# EAGLE design Adafruit UPDI Friend (EAGLE 9.6.2)
COMPANY: ADAFRUIT INDUSTRIES; DRAWN: KTOWN; REV: A
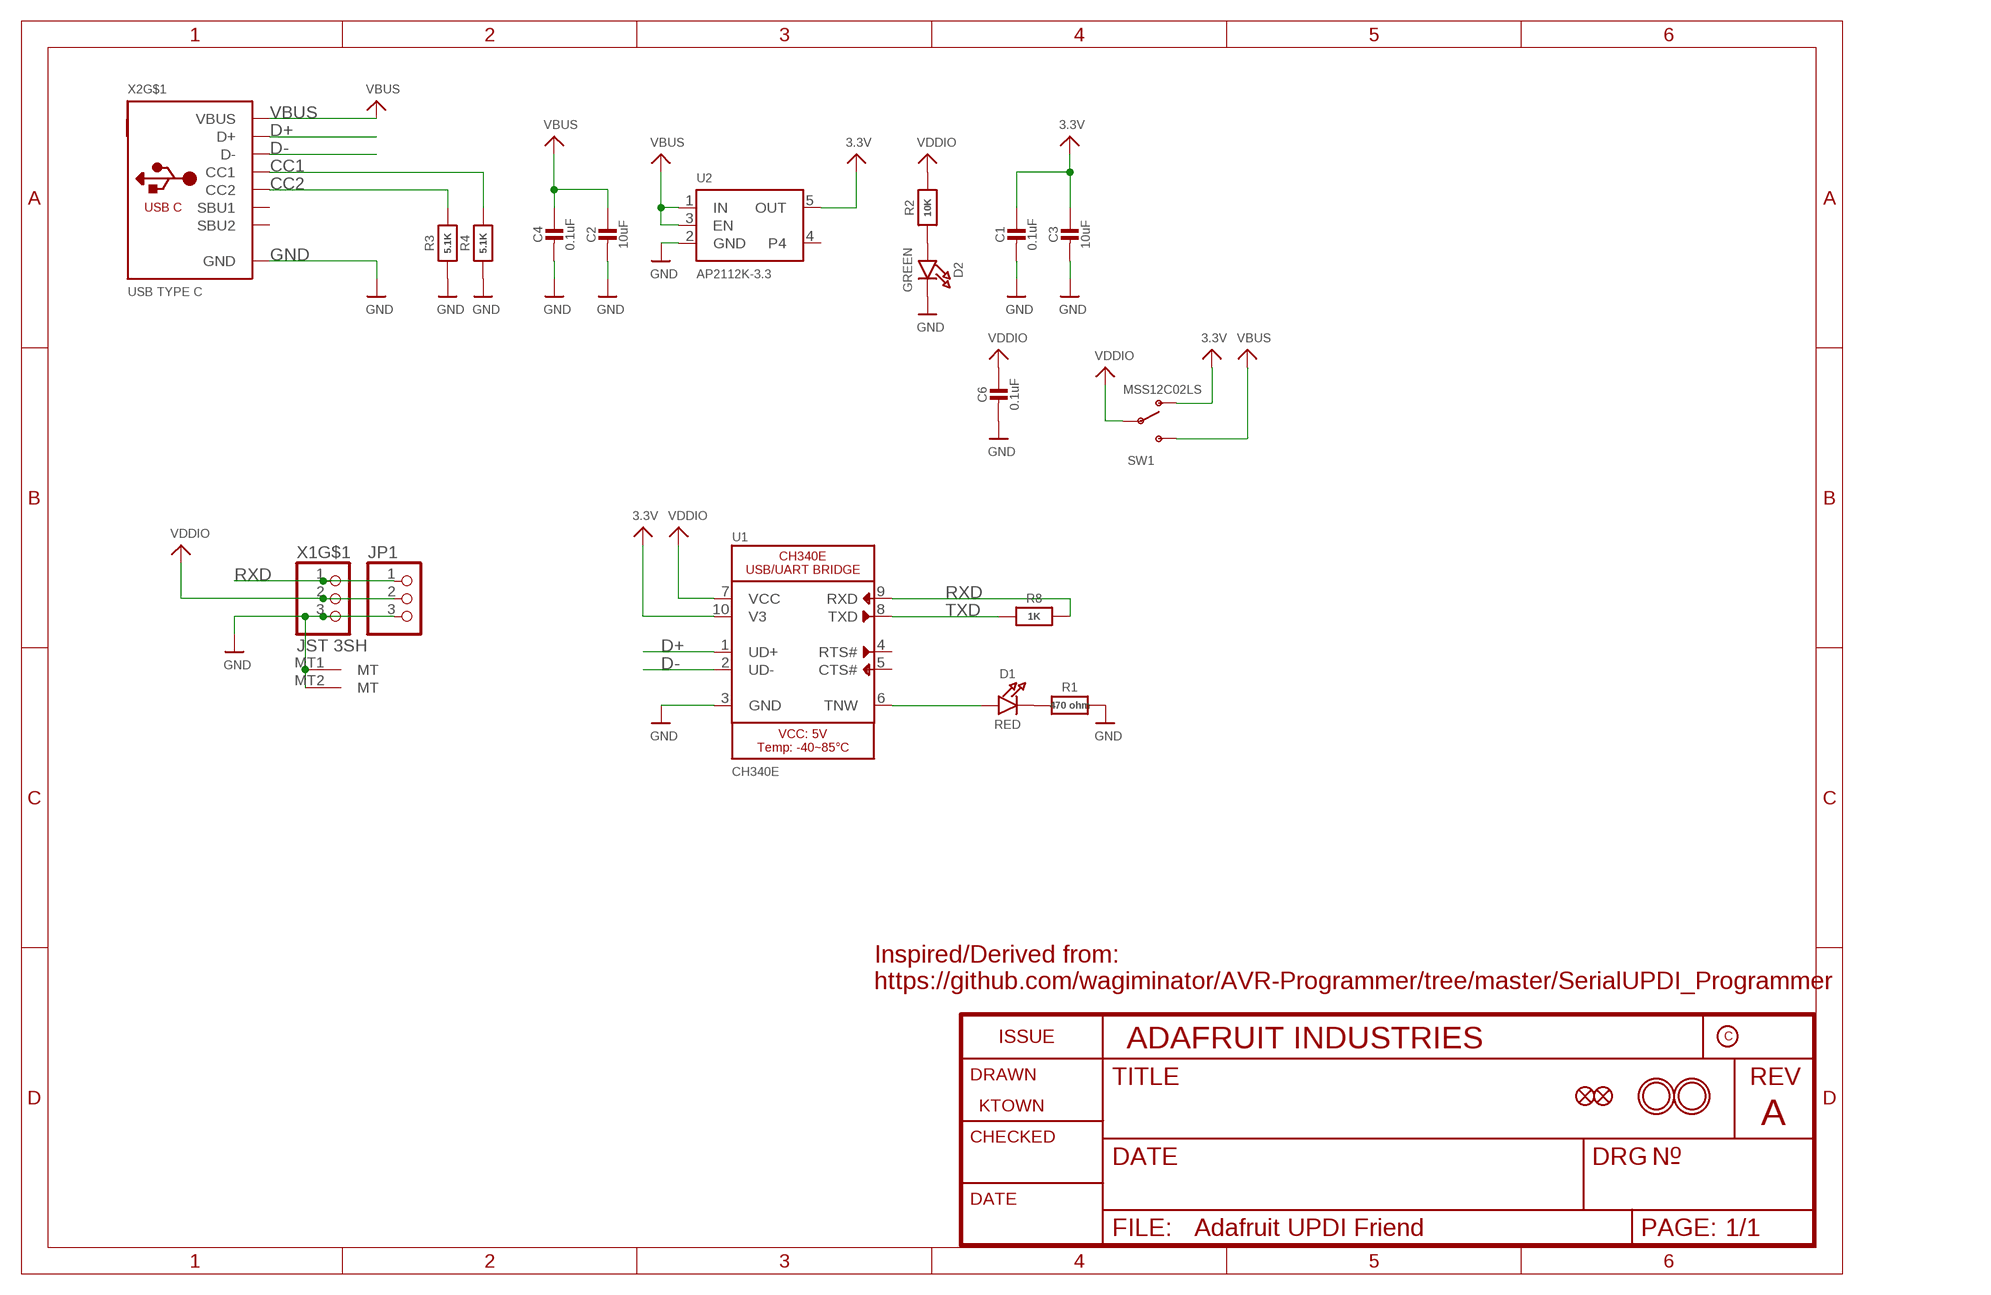
[diagram p0: schematic, sheet 1]

## Parts
C1  0.1uF  CAP_CERAMIC0603_NO  [0603-NO]
C2  10uF  CAP_CERAMIC0805-NOOUTLINE  [0805-NO]
C3  10uF  CAP_CERAMIC0805-NOOUTLINE  [0805-NO]
C4  0.1uF  CAP_CERAMIC0603_NO  [0603-NO]
C6  0.1uF  CAP_CERAMIC0603_NO  [0603-NO]
D1  RED  LED0603_NOOUTLINE  [CHIPLED_0603_NOOUTLINE]
D2  GREEN  LED0603_NOOUTLINE  [CHIPLED_0603_NOOUTLINE]
FID1  FIDUCIAL_1MM  [FIDUCIAL_1MM]
FID2  FIDUCIAL_1MM  [FIDUCIAL_1MM]
JP1  HEADER-1X376MIL  [1X03_ROUND_76]
R1  470 ohm  RESISTOR_0603_NOOUT  [0603-NO]
R2  10K  RESISTOR_0603_NOOUT  [0603-NO]
R3  5.1K  RESISTOR_0603_NOOUT  [0603-NO]
R4  5.1K  RESISTOR_0603_NOOUT  [0603-NO]
R8  1K  RESISTOR_0603_NOOUT  [0603-NO]
SW1  MSS12C02LS  SWITCH_SPDT  [SPDT_SMT_SSSS811101]
U1  CH340E  CH340E_MSOP10  [MSOP10]
U2  AP2112K-3.3  VREG_SOT23-5  [SOT23-5]
U$18  MOUNTINGHOLE2.0  [MOUNTINGHOLE_2.0_PLATED]
U$19  MOUNTINGHOLE2.0  [MOUNTINGHOLE_2.0_PLATED]
X1  JST 3SH  CON_JST_SH_3PINHORZ  [JST_SH3]
X2  USB TYPE C  USB_C  [USB_C_CUSB31-CFM2AX-01-X]

## Nets
3.3V: C1.1 C3.1 SW1.A(O) U1.10(V3) U2.5(OUT)
CC1: R4.2 X2.A5(CC1)
CC2: R3.2 X2.B5(CC2)
D+: U1.1(UD+) X2.A6(D+) X2.B6(D+)
D-: U1.2(UD-) X2.A7(D-) X2.B7(D-)
GND: C1.2 C2.2 C3.2 C4.2 C6.2 D2.C JP1.3 R1.2 R3.1 R4.1 U1.3(GND) U2.2(GND) X1.3 X1.MT1(MT) X1.MT2(MT) X2.A1B12(GND) X2.B1A12(GND)
N$1: D1.C R1.1
N$2: D1.A U1.6(TNW)
N$5: D2.A R2.1
RXD: JP1.1 R8.2 U1.9(RXD) X1.1
TXD: R8.1 U1.8(TXD)
VBUS: C2.1 C4.1 SW1.C(S) U2.1(IN) U2.3(EN) X2.A4B9(VBUS) X2.B4A9(VBUS)
VDDIO: C6.1 JP1.2 R2.2 SW1.B(P) U1.7(VCC) X1.2
Unconnected: U1.4(RTS#) U1.5(CTS#) U2.4 X2.A8(SBU1) X2.B8(SBU2) X2.M1(MT) X2.M2(MT) X2.M3(MT) X2.M4(MT)

## Notes on the sheet
- Inspired/Derived from:
  https://github.com/wagiminator/AVR-Programmer/tree/master/SerialUPDI_Programmer

## Library data of the parts
C1-C4 C6 = microbuilder:CAP_CERAMIC: Ceramic Capacitors For new designs, use the packages preceded by an '_' character since they are more reliable: The following footprints should be used on most boards: _0402 - Standard footprint for regular board layouts _0603 - Standard footprint for regular board layouts _0805 - Standard footprint for regular board layouts _1206 - Standard footprint for regular board layouts For extremely tight-pitch boards where space is at a premium, the following 'micro-pitch' footprints can be used (smaller pads, no silkscreen outline, etc.): _0402MP - Micro-pitch footprint for very dense/compact boards _0603MP - Micro-pitch footprint for very dense/compact boards _0805MP - Micro-pitch footprint for very dense/compact boards _1206MP - Micro-pitch footprint for very dense/compact boards
D1 D2 = microbuilder:LED: LED 0603 - 0603 Surface Mount Package 2mA: Green LED - Low Power (3.9mcd, 2ma, 1.7Vf) - Digikey: 475-2709-2-ND Orange LED - Low Power (9.8mcd, 2ma, 1.8Vf) - Digikey: 475-1194-2-ND Red LED - Low Power (5mcd, 2ma, 1.8Vf) - Digikey: 475-1195-2-ND Yellow LED - Low Power (7mcd, 2ma, 1.8Vf) - Digikey: 475-1196-2-ND 5mA: Blue LED - Low Power (17mcd, 5ma, 2.9Vf) - Digikey: LNJ937W8CRACT-ND 0805 - 0805 Surface Mount Package 2mA: Red LED (8.8mcd, 2mA, 1.8Vf, Clear) - Low Power [Digikey: 475-2510-1-ND] Green LED (5mcd, 2mA, 1.8Vf, Clear) - Low Power [Digikey: 475-2730-1-ND] Yellow LED (11.3mcd, 2mA, 1.8Vf, Clear) - Low Power [Digikey: 475-2555-1-ND] 20mA: Red LED (104mcd, 20mA, Diffused) - LS R976 [Digikey: 475-1278-6-ND] Red LED (12mcd, 20mA, 2.0Vf, Clear) - APT2012EC [Digikey: 754-1128-1-ND] Green LED (15mcd, 20mA, 2.2Vf, Clear) - APT2012GC [Digikey: 754-1131-1-ND] Orange LED (160mcd, 20mA, 2.1Vf, Clear) - APT2012SECK [Digikey: 754-1130-1-ND] 1206 - 1206 Surface Mount Package Green LED (26mcd, 20mA, Diffused) - LG N971 [Digikey: 475-1407-6-ND] Red LED (15mcd, 20mA, Diffused) - LH N974 [Digikey: 475-1416-6-ND] Cree - Cree High-Power Surface Mount LEDs XPEBWT-L1-0000-00D50 - White 111lm 350mA 2.9Vf 6200K 110° XTEAWT-00-0000-00000LEE3 - White 114lm 350mA 2.85Vf 5000K 115° Everlight - Everlight 45-21 Series Surface Mount LEDs 45-21/QK2C-B2832AC2CB2/2T - Warm White 2000mcd 20mA 3.25Vf 3050K 120° 45-21/LK2C-B38452C4CB2/2T - Nuetral White 2000mcd 20mA 3.25Vf 4150K 120° 45-21/LK2C-B50634C6CB2/2T - Cold White 2200mcd 20mA 3.25Vf 5650K 120° PLCC2 Reverse Mount LS T77K-J1L2-1-0-2-R18-Z - Red 11.25mcd 2mA 1.8Vf 630nm 120° LO T77K-L1M2-24-Z - Orange 19.6mcd 2mA 1.8Vf 606nm 120° LY T77K-K2M1-26-Z - Yellow 15.7mcd 2mA 1.8Vf 587nm 120°; ROT: 270
FID1 FID2 = microbuilder:FIDUCIAL: Fiducial Alignment Points Various fiducial points for machine vision alignment.; BOM: EXCLUDE
JP1 = microbuilder:HEADER-1X3: PIN HEADER
R1-R4 R8 = microbuilder:RESISTOR: Resistors For new designs, use the packages preceded by an '_' character since they are more reliable: The following footprints should be used on most boards: _0402 - Standard footprint for regular board layouts _0603 - Standard footprint for regular board layouts _0805 - Standard footprint for regular board layouts _1206 - Standard footprint for regular board layouts For extremely tight-pitch boards where space is at a premium, the following 'micro-pitch' footprints can be used (smaller pads, no silkscreen outline, etc.): _0402MP - Micro-pitch footprint for very dense/compact boards _0603MP - Micro-pitch footprint for very dense/compact boards _0805MP - Micro-pitch footprint for very dense/compact boards _1206MP - Micro-pitch footprint for very dense/compact boards
SW1 = adafruit_electromech:SWITCH_SPDT: Switch - SPDT SSSS811101 - Horizontal Two Position SMT, 0.3A 4V [Mouser: 688-SSSS811101]
U1 = microbuilder:CH340E: CH340E Full Speed USB to UART Bridge Baud Rates: 50bps - 2Mbps Software compatible with CH341
U2 = adafruit_power:VREG_SOT23-5: SOT23-5 Fixed Voltage Regulators Part Current Out V Out V In V Dropout θJA (°C/W) TJ (°C) Digikey Part No. ADP121 150mA 3.3V 3.4-5.5V 0.09V @ 150mA -- -- ADP121-AUJZ33R7CT-ND ADP121 150mA 3.0V 3.1-5.5V 0.09V @ 150mA -- -- ADP121-AUJZ30R7CT-ND ADP122 300mA 3.3V 3.4-5.5V 0.085V @ 300mA -- -- ADP122AUJZ-3.3-R7CT-ND ADP1712 300mA 3.3V 3.5-5.5V 0.17V @ 300mA -- -- ADP1712AUJZ-3.3-R7TR-ND AP7311 (Low Cost) 150mA 3.3V 3.5-6V 0.15V @ 150mA -- -- AP7311-33WG-7DICT-ND LD39015M18R 150mA 1.8V 1.9V-5.5V 0.08V @ 100mA -- -- 497-6977-1-ND LP2985A-33DBVR 150mA 3.3V 3.3-16V 0.28V @ 150mA 206 150 296-18479-1-ND MCP1824T-3302E/OT 300mA 3.3V 3.5V-6V 0.2V @ 300mA -- -- MCP1824T-3302E/OTCT-ND MIC5205-2.5YM5 TR 150mA 2.5V 2.7-16V 0.165V @ 150mA -- -- 576-1257-2-ND MIC5205-3.0YM5 TR 150mA 3.0V 3.2V-16V 0.165V @ 150mA -- -- 576-1258-2-ND MIC5205-3.3YM5 TR 150mA 3.3V 3.5V-16V 0.165V @ 150mA -- -- 576-1259-2-ND TPS780330220 150mA 3.3V+2.2V 3.6-5.5V 250mV Max -- -- 296-23332-1-ND TDA3663/N1,135 100mA 3.3V 3.5-45V 0.18V @ 50mA -- -- 568-5343-1-ND Max operating temp can be calculated using θJA, TJ (max junction temperature), and power in watts. Set the "Maximum Ambient Temperature" until it reaches TJ ("Max Junction Temperature"), which is the absolute limit for safe use of the regulator: Heat Sink Temperature Calculator <http://www.daycounter.com/Calculators/Heat-Sink-Temperature-Calculator.phtml> For example, With 12V source into a 3.3V LP2985 and a 30mA load, we are dissipating (12V-3.3V) * 0.03A = 0.261W. With a θJA of 206 °C/W, a TJ of 150°C, and 261mW we can safely use the chip without a heat sink up to 75°C (=147.1°C Junction Temperature).; JLC_ROTATION: 0
U$18 U$19 = adafruit_electromech:MOUNTINGHOLE: Mounting Hole For #2 screws (0.086"/2.18mm width, 0.094"/2.4mm hole) use 2.5mm; BOM: EXCLUDE
X1 = adafruit_electromech:CON_JST_SH_3PIN
X2 = adafruit_electromech:USB_C: USB Type-C USB 2.0 Connector; LCSC: C165948

## Board
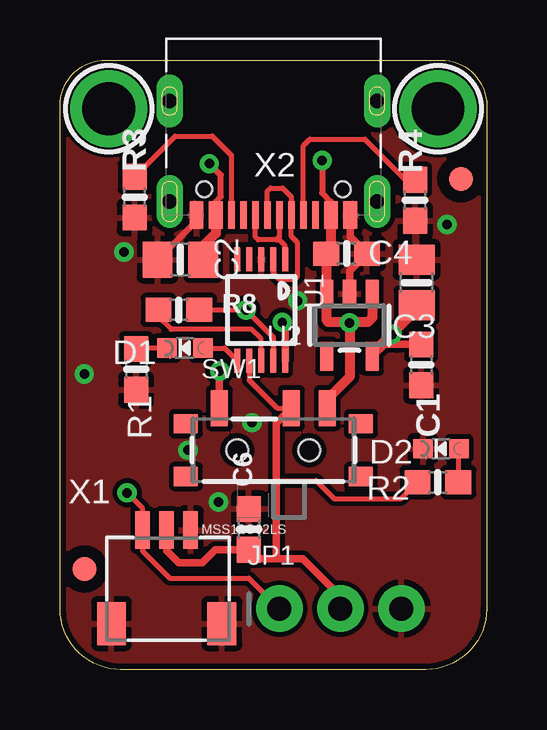
[diagram p1: board, top side]
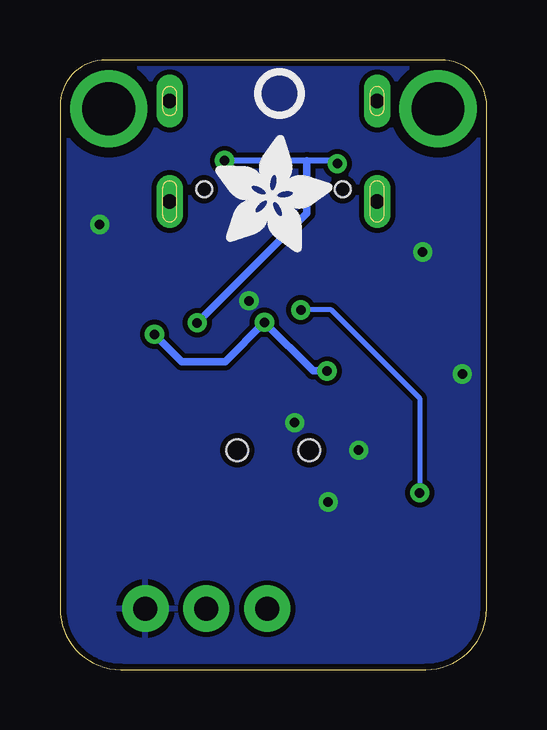
[diagram p2: board, bottom side, seen from below]

Size 17.78 x 25.4 mm. Coordinates in mm from the lower left corner, seen from the top.
Outline: 17.78,23.5 17.78,2.54 arc-90 15.24,0 2.54,0 arc-90 0,2.54 0,23.5 arc-90 1.91,25.4 15.88,25.4 arc-90 17.78,23.5
Copper layers (1*16): Top 0.035mm / dielectric 1.5mm / Bottom 0.035mm
Design rules "adafruit *": minimum track width 8mil, minimum drill 15.5mil, track to track 8mil, track to pad 8mil, pad to pad 8mil, via to via 8mil, smd to smd 8mil, copper to edge 10mil, drill to drill 8mil, minimum pad ring 10mil, minimum via ring 8mil, stop-mask expansion 2mil, vias tented up to drill 20mil, thermal gap 10mil

### Footprints (pad centres in the part's own frame; a part is rotated, then mirrored left to right if it is on the bottom)
0603-NO = smd 1.075 x 1: 1 -0.85,0; 2 0.85,0
0805-NO = smd 1.24 x 1.5: 1 -0.95,0; 2 0.95,0
CHIPLED_0603_NOOUTLINE = smd 0.8 x 0.8: A 0,-0.75; C 0,0.75
FIDUCIAL_1MM = smd 1 x 1: 1 0,0
1X03_ROUND_76 = drill 1 pad 1.93: 1 -2.54,0; 2 0,0; 3 2.54,0
SPDT_SMT_SSSS811101 = smd 0.7 x 1.5: A -2.25,1.242; B 0.75,1.242; C 2.25,1.242 | smd 1 x 0.8: SUP1 -3.65,0.592; SUP2 -3.65,-1.608; SUP3 3.65,0.592; SUP4 3.65,-1.608 | hole 0.9: -1.5,-0.508; 1.5,-0.508
MSOP10 = smd 0.25 x 1: 1 -1,-2.113; 2 -0.5,-2.113; 3 0,-2.113; 4 0.5,-2.113; 5 1,-2.113; 6 1,2.113; 7 0.5,2.113; 8 0,2.113; 9 -0.5,2.113; 10 -1,2.113
SOT23-5 = smd 0.55 x 1.2: 1 -0.95,-1.3; 2 0,-1.3; 3 0.95,-1.3; 4 0.95,1.3; 5 -0.95,1.3
MOUNTINGHOLE_2.0_PLATED = drill 2.2 pad 3: P$1 0,0
JST_SH3 = smd 0.6 x 1.55: 1 -1,2.006; 2 0,2.006; 3 1,2.006 | smd 1.2 x 1.8: MT1 -2.3,-1.894; MT2 2.3,-1.894
USB_C_CUSB31-CFM2AX-01-X = smd 0.575 x 1.15: A1B12 -3.2,2.275; A4B9 -2.4,2.275; B1A12 3.2,2.275; B4A9 2.4,2.275 | smd 0.275 x 1.15: A5 -1.25,2.275; A6 -0.25,2.275; A7 0.25,2.275; A8 1.25,2.275; B5 1.75,2.275; B6 0.75,2.275; B7 -0.75,2.275; B8 -1.75,2.275 | drill 0.6 pad 1 long: M1 -4.32,1.7; M2 4.32,1.7; M3 -4.32,-2.48; M4 4.32,-2.48 | hole 0.65: 2.89,1.2; -2.89,1.2

### Placement (x,y rotation side)
C1  15.05,12.7 270 top
C2  5.02,17.08 180 top
C3  14.86,16.13 90 top
C4  11.94,17.34 0 top
C6  7.87,5.84 90 top
D1  5.21,13.4 90 top
D2  15.88,9.21 90 top
FID1  1.02,4.19 0 top
FID2  16.7,20.45 0 top
JP1  11.68,2.54 0 top
PLABEL0  [PLABEL0]  9.14,3.68 90 top
PLABEL1  [PLABEL1]  11.68,3.68 90 top
PLABEL2  [PLABEL2]  14.22,3.68 90 top
PLABEL3  [PLABEL3]  13.72,8.13 90 top
PLABEL4  [PLABEL4]  4.06,8.38 90 top
PLABEL5  [PLABEL5]  4.19,12.19 0 top
PLABEL6  [PLABEL6]  14.48,10.41 0 top
PLABEL7  [PLABEL7]  2.16,5.71 90 top
PLABEL8  [PLABEL8]  9.02,13.72 0 bottom
PLABEL9  [PLABEL9]  3.17,1.4 90 bottom
PLABEL10  [PLABEL10]  4.45,1.4 90 bottom
PLABEL11  [PLABEL11]  5.71,1.4 90 bottom
PLABEL12  [PLABEL12]  4.57,5.97 0 bottom
R1  3.17,12.51 270 top
R2  15.75,7.81 180 top
R3  3.11,19.68 90 top
R4  14.8,19.56 90 top
R8  4.95,14.99 0 top
SW1  8.89,9.65 0 top
U1  8.38,14.99 180 top
U2  12.06,14.35 180 top
U$9  [ADAFRUIT_5MM]  11.3,17.4 0 bottom
U$17  [PCBFEAT-REV-040]  8.64,24 0 bottom
U$18  15.75,23.37 0 top
U$19  2.03,23.37 0 top
X1  4.45,3.81 0 top
X2  8.89,21.21 180 top

### Tracks (layer width: path | path; a pad name or v marks a point on that pad's centre or on a via)
3.3V  (via drill 0.39)
  Top 0.305: U2.5 13.52,13.56 C1.1 14.03,13.55 13.73,13.86 v13.84,13.97 | v9.26,14.47 9.38,14.35 U1.10 | SW1.A 6.64,12.43 v6.65,12.44
  Top 0.406: C3.1 14.86,15.02 13.02,13.18 U2.5
  Bottom 0.305: v13.84,13.97 12.7,12.83 10.9,12.83 v9.26,14.47 7.24,12.44 v6.65,12.44
CC1
  Top 0.203: X2.A5 10.14,21.82 10.41,22.1 12.7,22.1 14.39,20.41 R4.2
CC2
  Top 0.203: R3.2 4.8,22.23 6.35,22.23 7.14,21.43 X2.B5
D+
  Top 0.203: X2.A6 9.14,18.03 9.08,17.97 | 9.08,17.97 9.02,17.91 8.26,17.91 8.14,18.02 X2.B6 | U1.1 9.38,17.67 9.08,17.97
D-
  Top 0.203: X2.A7 8.64,19.94 8.76,20.07 9.27,20.07 9.64,19.7 X2.B7 9.64,18.05 9.91,17.78 9.91,16.38 9.78,16.26 9.14,16.26 8.88,16.52 U1.2
GND  (via drill 0.39)
  Top 0.254: X2.B1A12 5.69,18.7 C2.2
  Top 0.305: X2.A1B12 12.09,18.03 C4.2 12.06,16.61 U2.2
  other vias: 9.91,15.37 5.33,9.14 8,10.29 1.02,12.32 2.67,17.4 16.13,18.54 6.6,6.99
  pour Top: 17.78,25.27 0,25.27 0,0 17.78,0
  pour Bottom: 17.78,25.4 0,25.27 0,0 17.78,0
N$1
  Top 0.203: D1.C 3.21,13.4 R1.1
N$2
  Top 0.203: D1.A 6.86,13.4 U1.6
N$5
  Top 0.203: D2.A 16.6,9.18 R2.1
RXD  (via drill 0.39)
  Top 0.203: R8.2 v7.75,14.99 8.88,13.85 U1.9 | JP1.1 7.87,3.81 4.57,3.81 3.44,4.94 X1.1 3.44,6.71 v2.79,7.37
  Bottom 0.203: v2.79,7.37 2.79,11.3 6.48,14.99 v7.75,14.99
TXD
  Top 0.203: U1.8 8.38,13.78 7.98,14.18 4.63,14.18 4.1,14.71 R8.1
VBUS  (via drill 0.39)
  Top 0.254: X2.B4A9 6.49,19.5 6.71,19.72 6.71,20.6 v6.22,21.08 | v10.92,21.21 10.92,19.87 11.29,19.5 X2.A4B9
  Top 0.406: U2.1 13.02,14.67 12.83,14.48 12.06,14.48 | 12.06,14.48 11.18,14.48 11.12,14.54 U2.3 11.09,15.68 C4.1 11.29,17.54 X2.A4B9 | X2.B4A9 6.49,18.17 5.97,17.65 C2.1 | 12.06,14.48 v12.06,14.45 12.06,12.19 11.14,11.27 SW1.C
  Bottom 0.254: v6.22,21.08 6.35,21.21 7.49,21.21 v10.92,21.21
  Bottom 0.305: 7.49,21.21 7.49,19.18 7.49,19.02 v12.06,14.45
VDDIO
  Top 0.203: U1.7 7.88,12.06 9.04,10.89 SW1.B | 9.02,7.87 10.67,7.87 11.43,7.11 14.2,7.11 R2.2
  Top 0.305: X1.2 4.45,4.95 4.95,4.45 5.93,4.45 6.48,4.99 C6.1 8.26,4.61 9.02,4.61 | 9.02,4.61 10.12,4.61 11.68,3.05 JP1.2 | SW1.B 9.02,10.27 9.02,7.87 9.02,4.61

### Text on the board
Pinguin_tBackup: TX | PWR | 3V | 5V | UPDI Friend | UPDI | PWR | GND
Pinguin_bBackup: CH340E USB Serial / UPDI Programmer / 3 or 5V power/IO | JST-SH | UPDI | PWR | GND